# EAGLE design WLED 01 v0.9 (EAGLE 9.3.2)
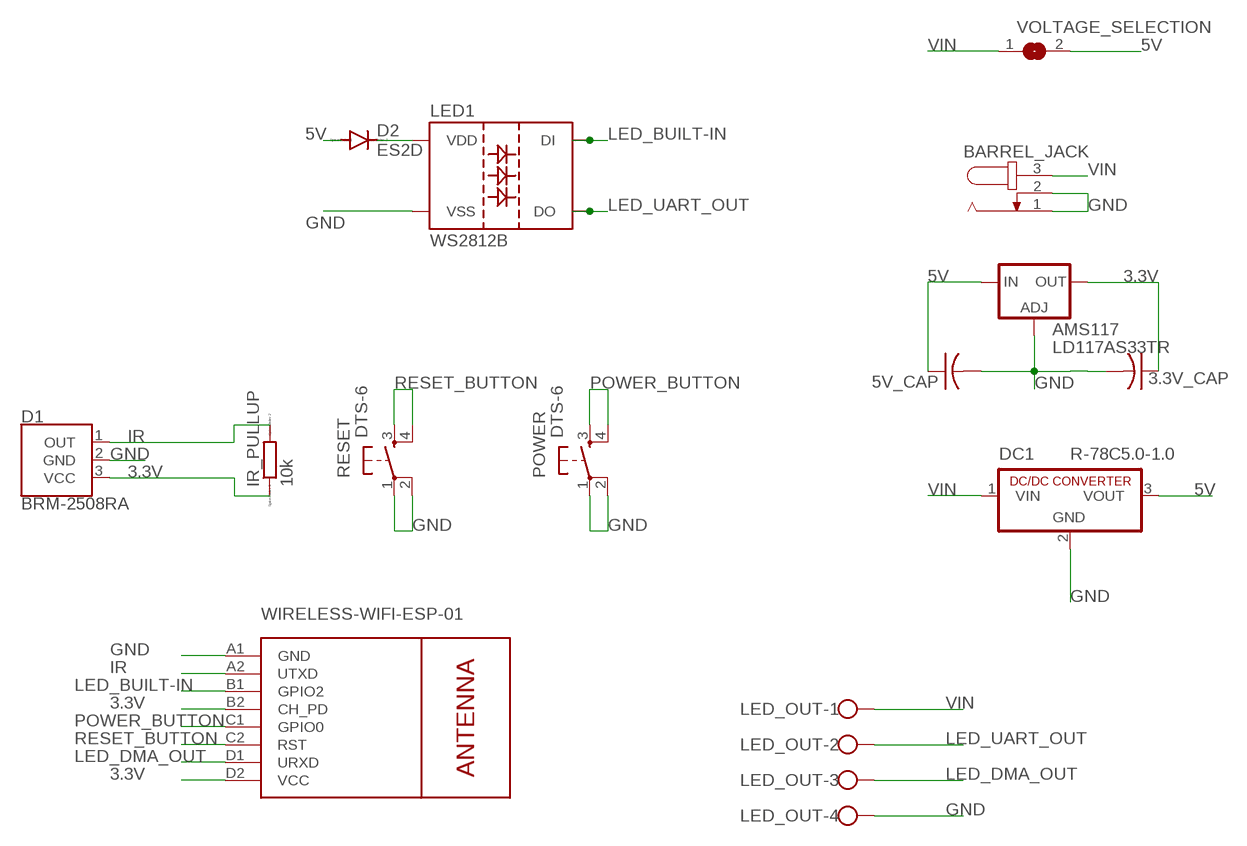
[diagram p0: schematic, sheet 1]

## Parts
3.3V_CAP  C-USC0805K  [C0805K]
5V_CAP  C-USC0805K  [C0805K]
AMS117  LD117AS33TR  [SOT223]
BARREL_JACK  JACK-PLUG0  [SPC4077]
D1  BRM-2508RA  [BRM-2508]
D2  ES2D  [SMB]
DC1  R-78C5.0-1.0  [SIP3]
IR_PULLUP  10k  RR0603  [R0603]
LED1  WS2812B  [WS2812B]
LED_OUT  W237-4  [W237-4]
POWER  DTS-6  [DTS-6]
RESET  DTS-6  [DTS-6]
U$1  WIRELESS-WIFI-ESP-01  [WIRELESS-WIFI-ESP-01]
VOLTAGE_SELECTION  SJ  [SJ]

## Nets
3.3V: 3.3V_CAP.1 AMS117.4(OUT) D1.3(VCC) IR_PULLUP.1 U$1.B2(CH_PD) U$1.D2(VCC)
5V [power]: 5V_CAP.1 AMS117.3(IN) D2.A DC1.3(VOUT) VOLTAGE_SELECTION.2
GND: 3.3V_CAP.2 5V_CAP.2 AMS117.1(ADJ) BARREL_JACK.1 BARREL_JACK.2 D1.2(GND) DC1.2(GND) LED1.3(VSS) LED_OUT.4 POWER.1 POWER.2 RESET.1 RESET.2 U$1.A1(GND)
IR: D1.1(OUT) IR_PULLUP.2 U$1.A2(UTXD)
LED_BUILT-IN: LED1.4(DI) U$1.B1(GPIO2)
LED_DMA_OUT: LED_OUT.3 U$1.D1(URXD)
LED_UART_OUT: LED1.2(DO) LED_OUT.2
N$2: D2.C LED1.1(VDD)
POWER_BUTTON: POWER.3 POWER.4 U$1.C1(GPIO0)
RESET_BUTTON: RESET.3 RESET.4 U$1.C2(RST)
VIN: BARREL_JACK.3 DC1.1(VIN) LED_OUT.1 VOLTAGE_SELECTION.1

## Library data of the parts
3.3V_CAP 5V_CAP = rcl:C-US: CAPACITOR, American symbol; SPICEPREFIX: C
AMS117 = v-reg:LD117A?*: Low drop fixed and adjustable positive voltage regulators 1 A Source: http://www.st.com/stonline/products/literature/ds/7194/ld1117axx.pdf
BARREL_JACK = con-jack:JACK-PLUG: DC POWER JACK Power Jack, DC, Right Angle, Through Hole, Rated 5A at 16VDC, PC Terminals Distributor: Farnell (www.Farnell.de) Drawing: 84N1161.pdf / 84N1162.pdf Manufacturer: SPC Technology (www.spctechnology.com) Type: SPC4077 / SPC 4078; OC_FARNELL: unknown; OC_NEWARK: unknown
D1 = SparkFun-Sensors:BRM-2508: BRM-2508 IR Receiver Module 2.7V/5.5V IR Receiver with Low Power Consumption, High-immunity Against Ambient Light. Example Datasheet <http://www.sinoskysun.com/upload/20110512/201105120447164615.PDF>; PROD_ID: COMP-12059
D2 = diode:ES2D: DIODE super fast rectifier, 2 A
DC1 = dc-dc-converter:R-78C*-1.0: INNOLINE DC/DC-Converter 1.0 AMP SIP3 Single Output Source: Data sheet <http://www.mikrocontroller.net/attachment/150645/157764-da-01-en-DC_DC_WANDLER_R_78C5_0_1_0.pdf>
IR_PULLUP = eagle-ltspice:R: RESISTOR, European symbol; SPICEMODEL: NONE; SPICEPREFIX: R
LED1 = WS2812:WS2812B
LED_OUT = con-wago-500:W237-4: WAGO SCREW CLAMP; OC_FARNELL: unknown; OC_NEWARK: unknown
POWER RESET = switch-tact:DTS-6
U$1 = diy-modules_mod:WIRELESS-WIFI-ESP-01: Wireless Wi-Fi ESP-01 Module based on ESP8266 chip Click here to find device on ebay.com <http://www.ebay.com/sch/esp8266+esp+01+transceiver>
VOLTAGE_SELECTION = jumper:SJ: SMD solder JUMPER

## Net classes
0 default: width 0.356 mm, clearance 0.254 mm
1 power: width 0.813 mm, clearance 0.33 mm

## Board
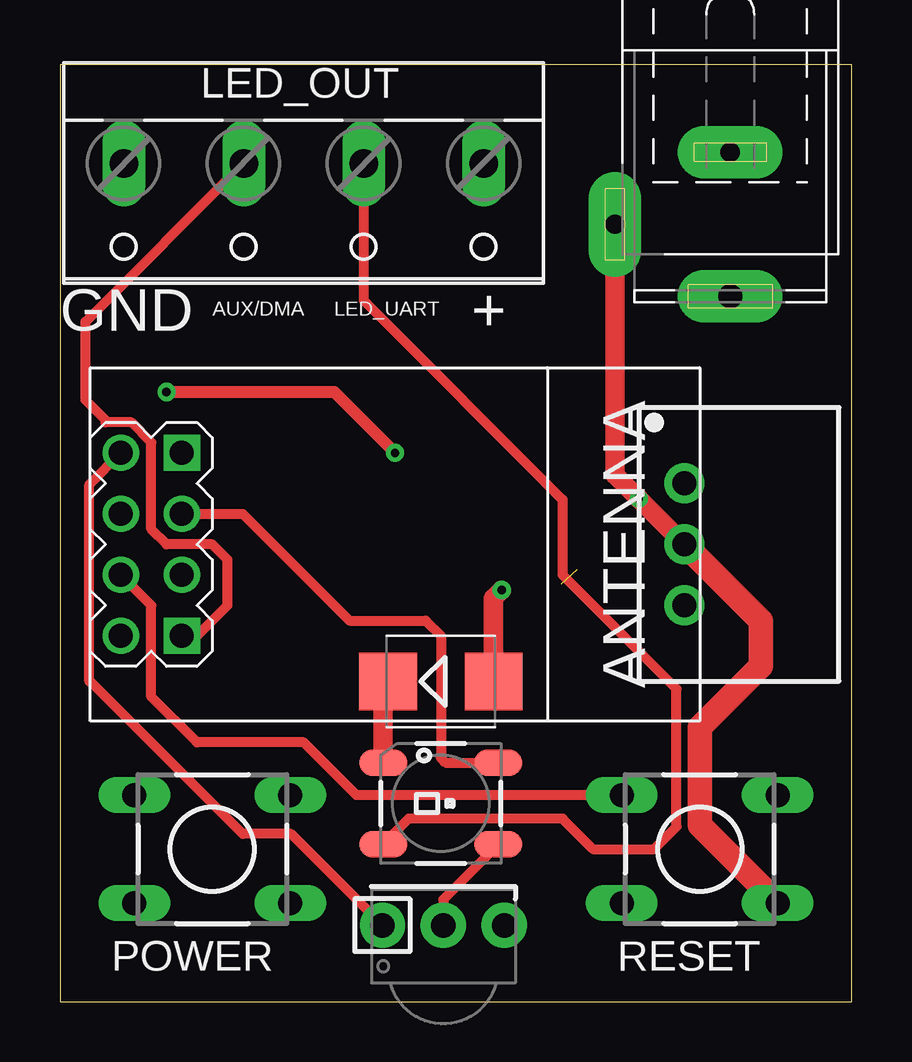
[diagram p1: board, top side]
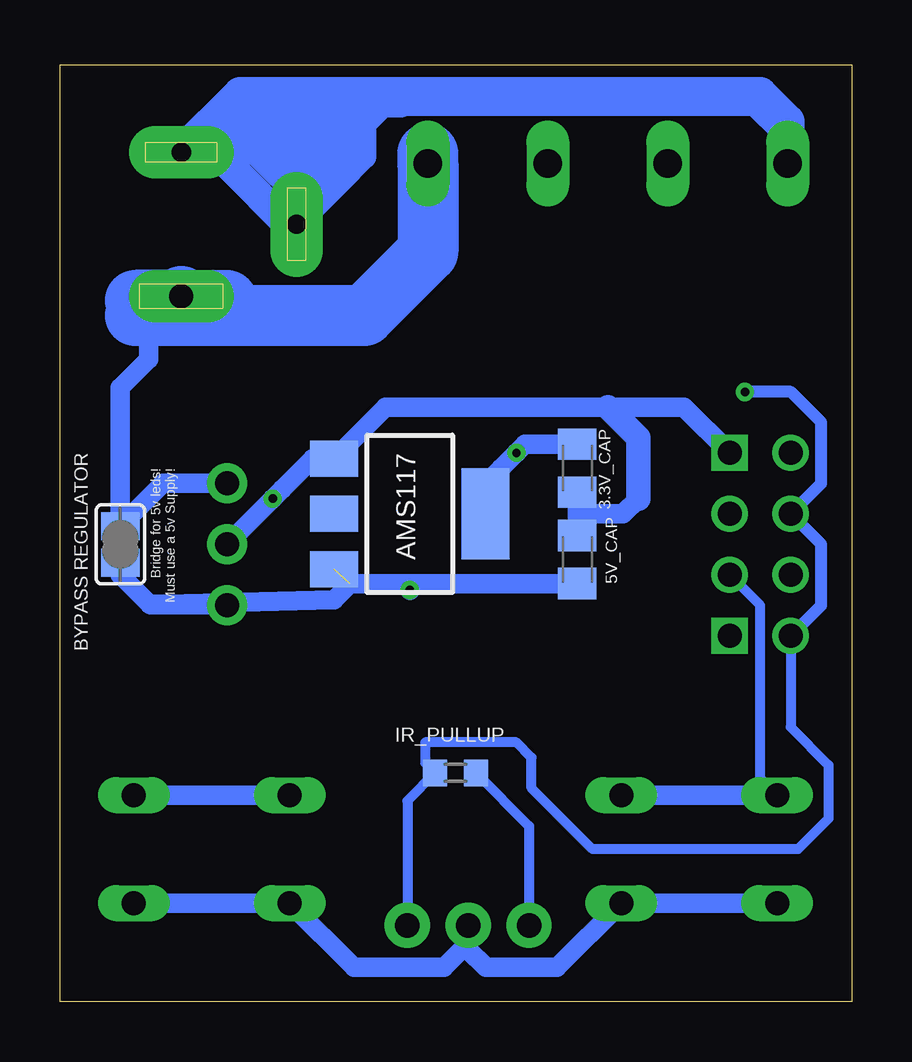
[diagram p2: board, bottom side, seen from below]

Size 33 x 39.04 mm. Coordinates in mm from the lower left corner, seen from the top.
Outline: 0,0 33,0 33,39.04 0,39.04 0,0
Copper layers (1*16): Top 0.035mm / dielectric 1.5mm / Bottom 0.035mm
Design rules "default *": minimum track width 6mil, minimum drill 0.35mm, track to track 6mil, track to pad 6mil, pad to pad 6mil, via to via 6mil, smd to smd 6mil, copper to edge 20mil, drill to drill 6mil, minimum pad ring 10mil, minimum via ring 8mil, stop-mask expansion 4mil, vias tented up to drill 0mil, thermal gap 10mil

### Footprints (pad centres in the part's own frame; a part is rotated, then mirrored left to right if it is on the bottom)
C0805K = smd 1.3 x 1.6: 1 -1,0; 2 1,0
SOT223 = smd 1.5 x 2: 1 -2.3,-3.15; 2 0,-3.15; 3 2.3,-3.15 | smd 3.8 x 2: 4 0,3.15
SPC4077 = drill 0.8 pad 2.184 long: 1 -3,0; 2 0,-4.8 | drill 1 pad 2.184 long: 3 3,0
BRM-2508 = drill 1.016 pad 1.88: 1 -2.54,0; 2 0,0; 3 2.54,0
SMB = smd 2.4 x 2.4: A 2.2,0; C -2.2,0
SIP3 = drill 1 pad 1.676: 1 -2.54,0; 2 0,0; 3 2.54,0
R0603 = smd 1 x 1.1: 1 -0.85,0; 2 0.85,0
WS2812B = smd 2 x 1.1: 1 -2.4,1.7; 2 -2.4,-1.7; 3 2.4,-1.7; 4 2.4,1.7
W237-4 = drill 1.194 long: 1 -7.5,-1.27; 2 -2.5,-1.27; 3 2.5,-1.27; 4 7.5,-1.27
DTS-6 = drill 1 long: 1 -3.25,2.25; 2 3.25,2.25; 3 -3.25,-2.25; 4 3.25,-2.25
WIRELESS-WIFI-ESP-01 = drill 1 square: A1 -8.89,3.81; D1 -8.89,-3.81 | drill 1: A2 -11.43,3.81; B1 -8.89,1.27; B2 -11.43,1.27; C1 -8.89,-1.27; C2 -11.43,-1.27; D2 -11.43,-3.81
SJ = smd 1.168 x 1.6: 1 -0.762,0; 2 0.762,0

### Placement (x,y rotation side)
3.3V_CAP  11.43,22.22 270 bottom
5V_CAP  11.43,18.42 90 bottom
AMS117  18.41,20.32 270 bottom
BARREL_JACK  27.94,32.39 270 top
D1  15.98,3.18 0 top
D2  15.88,13.33 0 top
DC1  26.03,19.05 270 top
IR_PULLUP  16.51,9.52 0 bottom
LED1  15.88,8.25 0 top
LED_OUT  10.16,33.66 180 top
POWER  6.35,6.35 180 top
RESET  26.67,6.35 180 top
U$1  13.97,19.05 0 top
VOLTAGE_SELECTION  30.48,19.05 270 bottom

### Tracks (layer width: path | path; a pad name or v marks a point on that pad's centre or on a via)
3.3V  (via drill 0.35)
  Top 0.508: v4.45,25.4 11.43,25.4 v13.97,22.86
  Bottom 0.356: 14.61,22.22 14.61,20.98 AMS117.4
  Bottom 0.406: D1.3 18.52,8.36 IR_PULLUP.1 17.78,9.95 17.78,10.79 13.97,10.79 13.34,10.16 13.34,8.89 10.79,6.35 2.23,6.35 0.96,7.62 0.96,9.86 2.54,11.43 U$1.D2
  Bottom 0.508: U$1.D2 1.27,16.51 1.27,19.05 U$1.B2 1.27,21.59 1.27,24.13 2.54,25.4 v4.45,25.4
  Bottom 0.813: 3.3V_CAP.1 13.61,23.22 v13.97,22.86 14.61,22.22 15.24,21.59 15.24,20.96
5V  (via drill 0.35)  (1 unrouted)
  Top 0.813: v18.41,17.14 18.07,16.81 D2.A
  Bottom 0.813: 28.58,16.56 29.21,16.54 26.06,16.54 DC1.3 | 28.58,16.56 21.56,16.75 20.9,17.42 18.41,17.42 | 18.41,17.42 5V_CAP.1 | 18.41,17.42 v18.41,17.14 | 28.58,16.56 29.26,16.56 30.48,17.78 VOLTAGE_SELECTION.2
GND  (via drill 0.35)
  Top 0.406: LED1.3 15.98,4.26 D1.2
  Top 0.813: BARREL_JACK.2 23.14,21.94 v24.13,20.96 DC1.2
  Top 1.016: RESET.1 26.67,7.35 26.67,11.43 29.21,13.97 29.21,15.88 DC1.2
  Bottom 0.813: DC1.2 v24.13,20.96 23.73,21.35 22.46,22.62 AMS117.1 19.42,24.76 10.16,24.76 6.98,24.76 U$1.A1 | 5V_CAP.2 11.43,20.32 | 11.43,20.32 3.3V_CAP.2 | 8.89,20.96 9.52,20.32 11.43,20.32 | POWER.2 POWER.1 12.28,1.42 15.24,1.42 15.98,2.16 D1.2 15.98,2.43 16.99,1.42 20.74,1.42 RESET.2 RESET.1
  Bottom 1.016: 23.14,33.66 BARREL_JACK.2 21.23,34.29 | 23.14,33.66 23.14,35.28 | 23.14,35.28 22.86,35.56 | 22.86,35.56 22.54,35.88 | 22.54,35.88 21.59,36.83 | 21.59,36.83 20.94,37.48 22.22,37.48 25.85,37.48 BARREL_JACK.1 | BARREL_JACK.1 23.24,35.39 23.14,35.28 | BARREL_JACK.1 24.87,35.39 23.14,33.66 | 22.86,34.29 22.86,35.56 | BARREL_JACK.1 26.49,36.83 21.59,36.83 | BARREL_JACK.1 27.45,35.88 22.54,35.88 | 22.86,34.29 21.27,35.88 20.32,36.83 20.32,35.2 21.31,35.2 22.22,34.29 21.23,34.29 | 22.86,34.29 22.86,33.66 | 20.46,35.06 21.23,34.29 | 8.89,20.96 8.89,23.5 10.16,24.76
  Bottom 1.27: BARREL_JACK.1 26.49,35.39 22.86,31.75 | 20.94,37.48 19.68,37.48 18.8,37.48 18.67,37.61 | 18.67,37.61 3.95,37.61 | 25.85,37.48 25.72,37.61 23.49,37.61 18.67,37.61
  Bottom 1.397: 23.49,37.61 3.95,37.61 2.66,36.31 LED_OUT.4 2.66,36.68 3.81,37.83 21.87,37.83 22.22,37.48 | 21.27,35.88 19.68,37.47 19.68,37.48 | 20.94,37.48 21.3,37.83 25.49,37.83 BARREL_JACK.1
IR
  Top 0.406: U$1.A2 1.22,21.54 1.22,13.33 1.27,13.33 7.62,6.98 9.63,6.98 D1.1
  Bottom 0.406: IR_PULLUP.2 13.44,7.3 D1.1
LED_BUILT-IN
  Top 0.406: LED1.4 16.08,9.96 15.88,10.16 15.88,15.24 15.24,15.88 12.06,15.88 7.62,20.32 U$1.B1
LED_DMA_OUT
  Top 0.406: U$1.D1 5.71,15.24 6.98,16.51 6.98,18.42 6.35,19.05 4.45,19.05 3.81,19.68 3.81,23.3 2.98,24.13 1.9,24.13 1.9,24.22 1.07,25.05 1.07,28.33 LED_OUT.3
LED_UART_OUT
  Top 0.406: LED_OUT.2 12.66,29.21 20.95,20.92 20.95,17.78 25.7,13.03 25.7,7.29 24.77,6.35 22.22,6.35 20.95,7.62 14.54,7.62 LED1.2
N$2
  Top 0.813: D2.C 13.47,13.14 LED1.1
POWER_BUTTON
  Bottom 0.406: POWER.4 3.81,9.31 3.81,16.51 U$1.C1
  Bottom 0.813: POWER.3 POWER.4
RESET_BUTTON
  Top 0.406: RESET.4 12.36,8.6 10.16,10.79 5.71,10.79 3.81,12.7 3.81,16.51 U$1.C2
  Bottom 0.813: RESET.3 RESET.4
VIN
  Bottom 0.508: 29.3,28.03 BARREL_JACK.3
  Bottom 0.813: 29.3,28.03 29.3,26.76 30.48,25.57 VOLTAGE_SELECTION.1 28.7,21.59 DC1.1
  Bottom 2.54: BARREL_JACK.3 27.13,28.57 20.32,28.57 17.66,31.24 LED_OUT.1 17.66,35.33 | BARREL_JACK.3 27.94,28.57 | BARREL_JACK.3 28.12,29.21 | 28.12,29.21 29.84,29.21 | 28.12,29.21 26.03,29.21 26.67,28.57 29.84,28.57

### Text on the board
tPlace: GND | AUX/DMA | LED_UART | +
bNames: Bridge for 5v leds! / Must use a 5v Supply! | BYPASS REGULATOR